# EAGLE design LPC_2TE_3.3 (EAGLE 5.00)
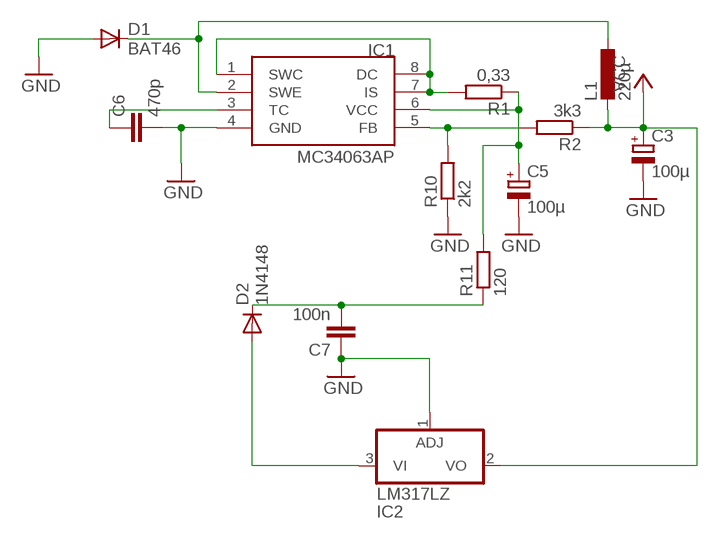
[diagram p0: schematic, sheet 1]

## Parts
C3  100µ  CPOL-EUE3.5-8  [E3,5-8]
C5  100µ  CPOL-EUE3.5-8  [E3,5-8]
C6  470p  C-EU025-024X044  [C025-024X044]
C7  100n  C-EU050-024X044  [C050-024X044]
D1  BAT46  BAT81  [DO34-7]
D2  1N4148  [DO35-10]
IC1  MC34063AP  [DIL08]
IC2  LM317LZ  [TO92]
L1  220µ  L-EU0207/2V  [0207/2V]
R1  0,33  R-EU_0207/2V  [0207/2V@1]
R2  3k3  R-EU_0207/2V  [0207/2V@1]
R10  2k2  R-EU_0207/2V  [0207/2V@1]
R11  120  R-EU_0207/10  [0207/10@1]

## Nets
GND: C3.- C5.- C6.2 C7.1 D1.A IC1.4(GND) IC2.1(ADJ) R10.1
N$1: D2.A IC2.3(VI)
N$8: IC1.1(SWC) IC1.7(IS) IC1.8(DC) R1.2
N$10: C5.+ IC1.6(VCC) R1.1 R11.2
N$11: IC1.5(FB) R2.2 R10.2
N$12: D1.C IC1.2(SWE) L1.1
N$13: C7.2 D2.C R11.1
N$14: C6.1 IC1.3(TC)
VCC: C3.+ IC2.2(VO) L1.2 R2.1

## Library data of the parts
C3 C5 = rcl:CPOL-EU: POLARIZED CAPACITOR, European symbol
C6 C7 = rcl:C-EU: CAPACITOR, European symbol
D1 = diode:BAT81: DIODE barrier diode
D2 = diode:1N4148: DIODE high speed (Philips)
IC1 = mc34063:MC34063
IC2 = linear:*317: Positive VOLTAGE REGULATOR
L1 = rcl:L-EU: INDUCTOR, European symbol
R1 R2 R10 R11 = rcl:R-EU_: RESISTOR, European symbol

## Board
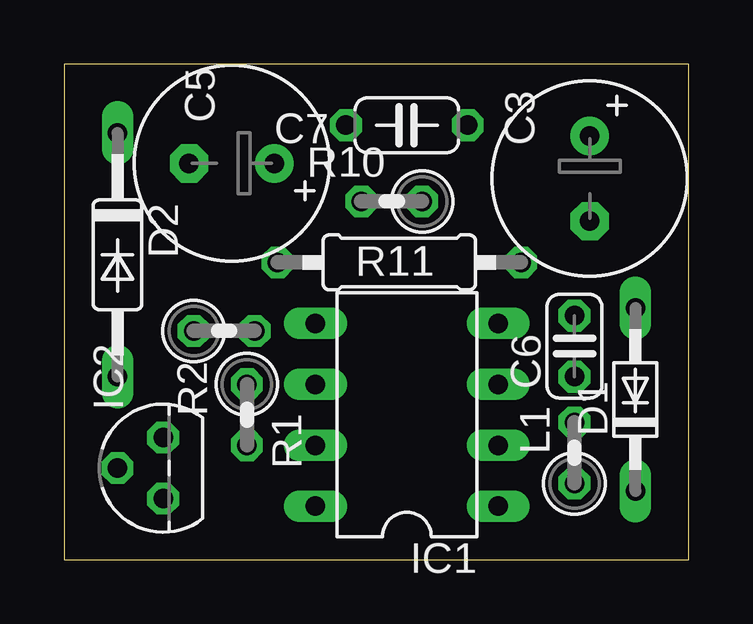
[diagram p1: board, top side]
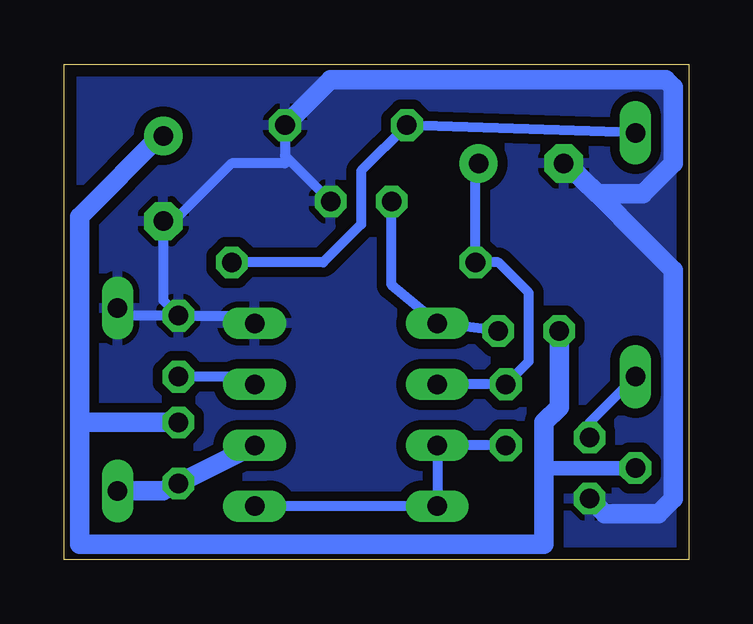
[diagram p2: board, bottom side, seen from below]

Size 26.04 x 20.64 mm. Coordinates in mm from the lower left corner, seen from the top.
Outline: 0,0 26.04,0 26.04,20.64 0,20.64 0,0
Copper layers (1*16): Top 0.035mm / dielectric 1.5mm / Bottom 0.035mm
Design rules "default *": minimum track width 10mil, minimum drill 24mil, track to track 12mil, track to pad 12mil, pad to pad 12mil, via to via 16mil, smd to smd 8mil, copper to edge 20mil, drill to drill 8mil, minimum pad ring 10mil, minimum via ring 8mil, stop-mask expansion 4mil, vias tented up to drill 0mil, thermal gap 10mil

### Footprints (pad centres in the part's own frame; a part is rotated, then mirrored left to right if it is on the bottom)
E3,5-8 = drill 0.813 pad 1.6 round: + -1.778,0 | drill 0.813 pad 1.6 octagon: - 1.778,0
C025-024X044 = drill 0.813 octagon: 1 -1.27,0; 2 1.27,0
C050-024X044 = drill 0.813 octagon: 1 -2.54,0; 2 2.54,0
DO34-7 = drill 0.813 long: A 3.81,0; C -3.81,0
DO35-10 = drill 0.813 long: A 5.08,0; C -5.08,0
DIL08 = drill 0.813 long: 1 -3.81,-3.81; 2 -1.27,-3.81; 3 1.27,-3.81; 4 3.81,-3.81; 5 3.81,3.81; 6 1.27,3.81; 7 -1.27,3.81; 8 -3.81,3.81
TO92 = drill 0.813 octagon: 1 -1.27,0; 2 0,1.905; 3 1.27,0
0207/2V = drill 0.813 octagon: 1 -1.27,0; 2 1.27,0
0207/2V@1 = drill 0.813 octagon: 1 -1.27,0; 2 1.27,0
0207/10@1 = drill 0.813 octagon: 1 -5.08,0; 2 5.08,0

### Placement (x,y rotation side)
C3  21.91,15.88 270 top
C5  6.98,16.51 180 top
C6  21.27,8.89 90 top
C7  14.29,18.1 180 top
D1  23.81,6.67 90 top
D2  2.22,12.7 270 top
IC1  14.29,6.03 90 top
IC2  4.13,3.81 90 top
L1  21.27,4.45 90 top
R1  7.62,6.03 270 top
R2  6.67,9.53 0 top
R10  13.65,14.92 180 top
R11  13.97,12.38 180 top

### Tracks (layer width: path | path; a pad name or v marks a point on that pad's centre or on a via)
GND
  Bottom 0.406: 5.08,16.51 C5.- | 16.67,16.67 R10.1 | 16.67,16.67 16.83,16.83 C7.1 17.15,18.1 | C6.2 21.91,10.8 C3.- 21.46,14.1 19.05,16.51 16.83,16.51 16.67,16.67 | IC1.4 18.73,10.16 C6.2 | C6.2 23.18,10.16 D1.A | 16.67,16.67
  Bottom 0.813: IC2.1 3.49,1.91 1.27,1.91 0.63,2.54 0.63,12.07 5.08,16.51 | C5.- 4.45,15.88 3.81,15.24 1.9,15.24 0.63,16.51 0.63,19.68 0.95,20 14.92,20 C7.1
  pour Bottom (isolate 0.406): 0,20.96 26.67,20.96 26.67,-0.32 0,-0.32 0,5.71
N$1
  Bottom 0.406: IC2.3 4.13,5.71 D2.A
N$8
  Bottom 0.406: R1.2 IC1.7 IC1.8 IC1.1
N$10
  Bottom 0.406: IC1.6 R1.1 6.67,8.26 6.67,11.11 7.94,12.38 R11.2 8.89,16.38 C5.+
N$11
  Bottom 0.406: R2.2 IC1.5 12.38,11.43 R10.2
N$12
  Bottom 0.813: D1.C 21.91,2.86 L1.1 IC1.2
N$13
  Bottom 0.406: D2.C C7.2 13.65,16.19 13.65,13.97 15.24,12.38 R11.1
N$14
  Bottom 0.406: IC1.3 18.73,7.62 C6.1
VCC
  Bottom 0.406: 21.91,5.71 21.59,5.71 | 21.91,17.78 C3.+
  Bottom 0.61: IC2.2 6.03,3.81
  Bottom 0.813: 21.59,5.71 L1.2 | 25.4,5.71 21.91,5.71 | 25.4,5.71 25.4,14.29 21.91,17.78 | 25.4,5.71 25.4,0.63 6.03,0.63 6.03,3.81 6.03,5.71 5.4,6.35 R2.1